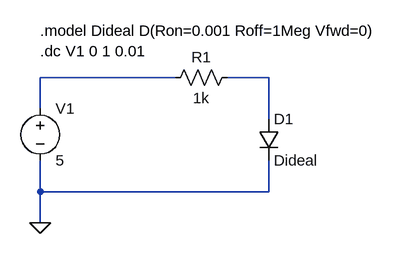
[diagram p0: schematic 2.4 ideal-diode.asc]
2.4 ideal-diode.asc, the LTspice schematic file:
Version 4
SHEET 1 880 680
WIRE 432 224 224 224
WIRE 576 224 512 224
WIRE 224 272 224 224
WIRE 576 288 576 224
WIRE 224 400 224 352
WIRE 576 400 576 352
WIRE 576 400 224 400
WIRE 224 448 224 400
FLAG 224 448 0
SYMBOL Voltage 224 256 R0
SYMATTR InstName V1
SYMATTR Value 5
SYMBOL Res 528 208 R90
WINDOW 0 0 56 VBottom 2
WINDOW 3 32 56 VTop 2
SYMATTR InstName R1
SYMATTR Value 1k
SYMBOL Diode 560 288 R0
SYMATTR InstName D1
SYMATTR Value Dideal
TEXT 224 152 Left 2 !.model Dideal D(Ron=0.001 Roff=1Meg Vfwd=0)\n.dc V1 0 1 0.01

The netlist it stands for:
* 2.4 ideal-diode.asc
V1 N001 0 5
R1 N002 N001 1k
D1 N002 0 Dideal
.model D D
.lib standard.dio
.model Dideal D(Ron=0.001 Roff=1Meg Vfwd=0)
.dc V1 0 1 0.01
.backanno
.end